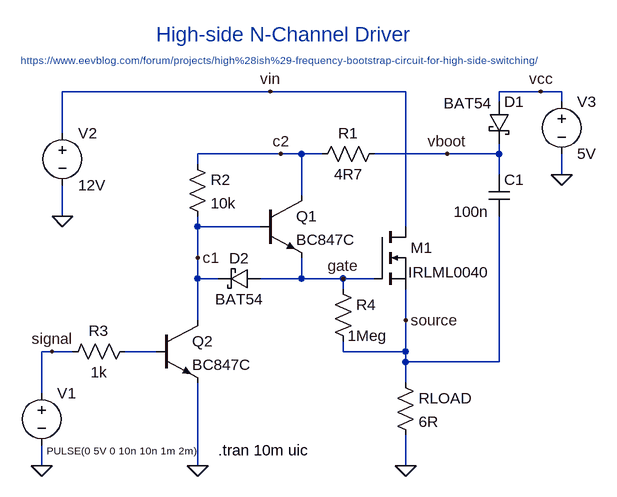
[diagram p0: schematic 01-high_side_n_mofet_driver.asc]
01-high_side_n_mofet_driver.asc, the LTspice schematic file:
Version 4
SHEET 1 1020 680
WIRE 96 -160 -224 -160
WIRE 304 -160 96 -160
WIRE 512 -160 448 -160
WIRE 544 -160 512 -160
WIRE 448 -144 448 -160
WIRE 544 -144 544 -160
WIRE -224 -96 -224 -160
WIRE 112 -64 -16 -64
WIRE 144 -64 112 -64
WIRE 176 -64 144 -64
WIRE 368 -64 256 -64
WIRE 448 -64 448 -80
WIRE 448 -64 368 -64
WIRE -16 -48 -16 -64
WIRE 448 -32 448 -64
WIRE 544 -32 544 -64
WIRE 144 0 144 -64
WIRE -224 32 -224 -16
WIRE -16 48 -16 32
WIRE 80 48 -16 48
WIRE 304 48 304 -160
WIRE -16 96 -16 48
WIRE -16 128 -16 96
WIRE 16 128 -16 128
WIRE 144 128 144 96
WIRE 144 128 80 128
WIRE 208 128 144 128
WIRE 256 128 208 128
WIRE 208 144 208 128
WIRE -16 192 -16 128
WIRE 304 192 304 144
WIRE -240 240 -256 240
WIRE -208 240 -240 240
WIRE -80 240 -128 240
WIRE 208 240 208 224
WIRE 304 240 304 192
WIRE 304 240 208 240
WIRE 304 256 304 240
WIRE 448 256 448 32
WIRE 448 256 304 256
WIRE 304 288 304 256
WIRE -256 304 -256 240
WIRE -256 416 -256 384
WIRE -16 416 -16 288
WIRE 304 416 304 368
FLAG 304 416 0
FLAG -16 416 0
FLAG -256 416 0
FLAG -224 32 0
FLAG 96 -160 vin
FLAG 368 -64 vboot
FLAG 208 128 gate
FLAG 304 192 source
FLAG -240 240 signal
FLAG -16 96 c1
FLAG 112 -64 c2
FLAG 544 -32 0
FLAG 512 -160 vcc
SYMBOL nmos 256 48 R0
WINDOW 3 52 70 Left 2
SYMATTR Value IRLML0040
SYMATTR InstName M1
SYMBOL res 288 272 R0
SYMATTR InstName RLOAD
SYMATTR Value 6R
SYMBOL res 272 -80 R90
WINDOW 0 0 56 VBottom 2
WINDOW 3 32 56 VTop 2
SYMATTR InstName R1
SYMATTR Value 4R7
SYMBOL cap 432 -32 R0
WINDOW 3 -54 57 Left 2
SYMATTR Value 100n
SYMATTR InstName C1
SYMBOL npn 80 0 R0
SYMATTR InstName Q1
SYMATTR Value BC847C
SYMBOL schottky 80 112 R90
WINDOW 0 0 32 VBottom 2
WINDOW 3 32 32 VTop 2
SYMATTR InstName D2
SYMATTR Value BAT54
SYMATTR Description Diode
SYMATTR Type diode
SYMBOL npn -80 192 R0
SYMATTR InstName Q2
SYMATTR Value BC847C
SYMBOL res -32 -64 R0
SYMATTR InstName R2
SYMATTR Value 10k
SYMBOL res -112 224 R90
WINDOW 0 0 56 VBottom 2
WINDOW 3 32 56 VTop 2
SYMATTR InstName R3
SYMATTR Value 1k
SYMBOL voltage -256 288 R0
WINDOW 3 8 105 Left 1
WINDOW 123 0 0 Left 0
WINDOW 39 0 0 Left 0
SYMATTR Value PULSE(0 5V 0 10n 10n 1m 2m)
SYMATTR InstName V1
SYMBOL voltage -224 -112 R0
WINDOW 123 0 0 Left 0
WINDOW 39 0 0 Left 0
SYMATTR InstName V2
SYMATTR Value 12V
SYMBOL voltage 544 -160 R0
WINDOW 123 0 0 Left 0
WINDOW 39 0 0 Left 0
SYMATTR InstName V3
SYMATTR Value 5V
SYMBOL schottky 432 -144 R0
WINDOW 3 -69 2 Left 2
SYMATTR Value BAT54
SYMATTR InstName D1
SYMATTR Description Diode
SYMATTR Type diode
SYMBOL res 192 128 R0
WINDOW 3 23 88 Left 2
SYMATTR InstName R4
SYMATTR Value 1Meg
TEXT 16 392 Left 2 !.tran 10m uic
TEXT -288 -208 Left 1 ;https://www.eevblog.com/forum/projects/high%28ish%29-frequency-bootstrap-circuit-for-high-side-switching/
TEXT -80 -248 Left 3 ;High-side N-Channel Driver

The netlist it stands for:
* 01-high_side_n_mofet_driver.asc
M1 vin gate source source IRLML0040
RLOAD source 0 6R
R1 vboot c2 4R7
C1 vboot source 100n
Q1 c2 c1 gate 0 BC847C
D2 gate c1 BAT54
Q2 c1 N001 0 0 BC847C
R2 c2 c1 10k
R3 N001 signal 1k
V1 signal 0 PULSE(0 5V 0 10n 10n 1m 2m)
V2 vin 0 12V
V3 vcc 0 5V
D1 vcc vboot BAT54
R4 gate source 1Meg
.model D D
.lib standard.dio
.model NPN NPN
.model PNP PNP
.lib standard.bjt
.model NMOS NMOS
.model PMOS PMOS
.lib standard.mos
.tran 10m uic
* https://www.eevblog.com/forum/projects/high%28ish%29-frequency-bootstrap-circuit-for-high-side-switching/
* High-side N-Channel Driver
.backanno
.end